# Altium schematic sheet Main.SchDoc: Плата
size 594 x 420 mm; CompanyName: ООО "ЛАССАРД"; Address1: Address1; Address2: Address2; Address3: Address3; Address4: Address4; DocumentNumber: *Э3; SheetNumber: 1; SheetTotal: 15; Title2str: управления; DocumentType: Схема электрическая принципиальная
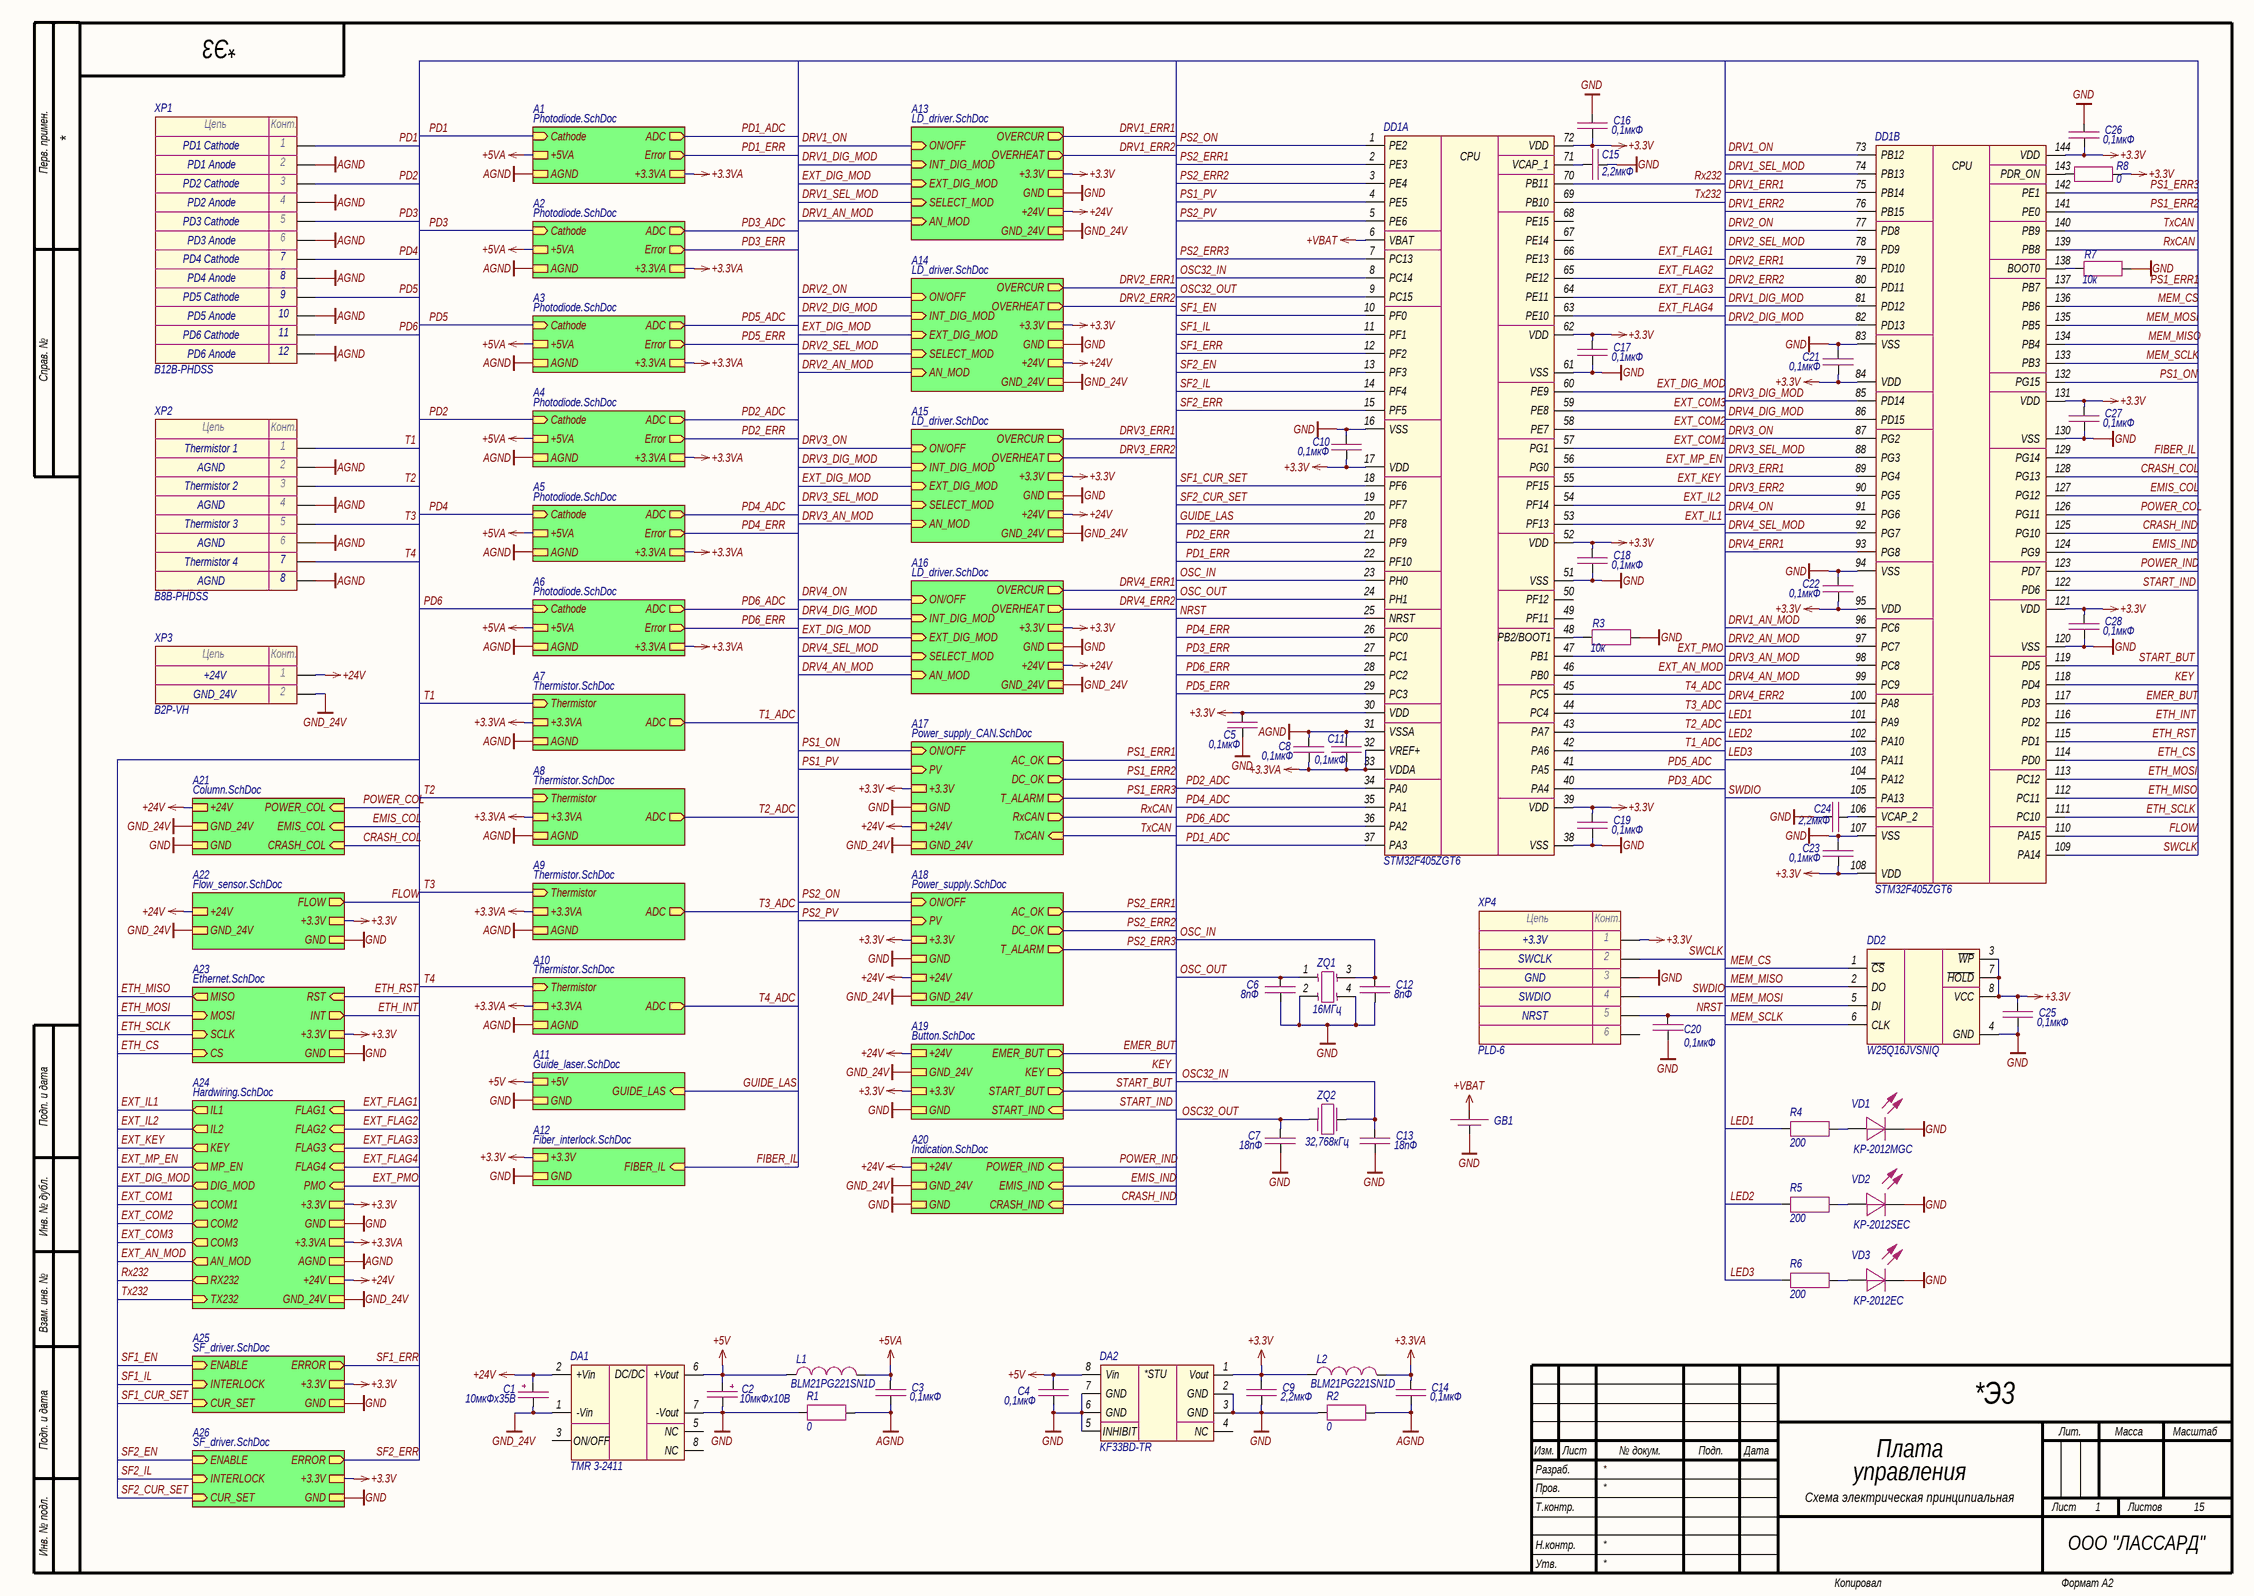
[diagram p0: Main.SchDoc]

## Parts
C1  10мкФх35B  [CAP_C]
C2  10мкФх10B  [CAP_A]
C3  0,1мкФ  [CAP_0603]
C4  0,1мкФ  [CAP_0603]
C5  0,1мкФ  [CAP_0603]
C6  8пФ  [CAP_0603]
C7  18пФ  [CAP_0603]
C8  0,1мкФ  [CAP_0603]
C9  2,2мкФ  [CAP_0603]
C10  0,1мкФ  [CAP_0603]
C11  0,1мкФ  [CAP_0603]
C12  8пФ  [CAP_0603]
C13  18пФ  [CAP_0603]
C14  0,1мкФ  [CAP_0603]
C15  2,2мкФ  [CAP_0603]
C16  0,1мкФ  [CAP_0603]
C17  0,1мкФ  [CAP_0603]
C18  0,1мкФ  [CAP_0603]
C19  0,1мкФ  [CAP_0603]
C20  0,1мкФ  [CAP_0603]
C21  0,1мкФ  [CAP_0603]
C22  0,1мкФ  [CAP_0603]
C23  0,1мкФ  [CAP_0603]
C24  2,2мкФ  [CAP_0603]
C25  0,1мкФ  [CAP_0603]
C26  0,1мкФ  [CAP_0603]
C27  0,1мкФ  [CAP_0603]
C28  0,1мкФ  [CAP_0603]
DA1  TMR 3-2411  [TMR3 (SIP-8)]
DA2  KF33BD-TR  [SOIC-8]
DD1  STM32F405ZGT6  [LQFP-144]  (parts A,B of 2)
DD2  W25Q16JVSNIQ  [SOIC-8]
GB1  DS1092-12-N8S  [DS1092-12-N8S]  (value not drawn)
L1  BLM21PG221SN1D  [IND_0805]
L2  BLM21PG221SN1D  [IND_0805]
R1  0  [RES_0805]
R2  0  [RES_0805]
R3  10к  [RES_0603]
R4  200  [RES_0603]
R5  200  [RES_0603]
R6  200  [RES_0603]
R7  10к  [RES_0603]
R8  0  [RES_0603]
VD1  KP-2012MGC  [LED_0805]
VD2  KP-2012SEC  [LED_0805]
VD3  KP-2012EC  [LED_0805]
XP1  B12B-PHDSS  [B12B-PHDSS]
XP2  B8B-PHDSS  [B8B-PHDSS]
XP3  B2P-VH  [B2P-VH]
XP4  PLD-6  [PLD-6]
ZQ1  16МГц  [NX2520SA]
ZQ2  32,768кГц  [NX3215SA]

## Sub-sheets
A1 = Photodiode.SchDoc: Cathode (in), ADC (out), Error (out), AGND, +5VA, +3.3VA
A2 = Photodiode.SchDoc: Cathode (in), ADC (out), Error (out), AGND, +5VA, +3.3VA
A3 = Photodiode.SchDoc: Cathode (in), ADC (out), Error (out), AGND, +5VA, +3.3VA
A4 = Photodiode.SchDoc: Cathode (in), ADC (out), Error (out), AGND, +5VA, +3.3VA
A5 = Photodiode.SchDoc: Cathode (in), ADC (out), Error (out), AGND, +5VA, +3.3VA
A6 = Photodiode.SchDoc: Cathode (in), ADC (out), Error (out), AGND, +5VA, +3.3VA
A7 = Thermistor.SchDoc: Thermistor (in), +3.3VA, AGND, ADC (out)
A8 = Thermistor.SchDoc: Thermistor (in), +3.3VA, AGND, ADC (out)
A9 = Thermistor.SchDoc: Thermistor (in), +3.3VA, AGND, ADC (out)
A10 = Thermistor.SchDoc: Thermistor (in), +3.3VA, AGND, ADC (out)
A11 = Guide_laser.SchDoc: GUIDE_LAS (in), +5V, GND
A12 = Fiber_interlock.SchDoc: FIBER_IL (in), +3.3V, GND
A13 = LD_driver.SchDoc: +3.3V, GND, OVERCUR (out), OVERHEAT (out), +24V, GND_24V, ON/OFF (in), INT_DIG_MOD (in), AN_MOD (in), EXT_DIG_MOD (in), SELECT_MOD (in)
A14 = LD_driver.SchDoc: +3.3V, GND, OVERCUR (out), OVERHEAT (out), +24V, GND_24V, ON/OFF (in), INT_DIG_MOD (in), AN_MOD (in), EXT_DIG_MOD (in), SELECT_MOD (in)
A15 = LD_driver.SchDoc: +3.3V, GND, OVERCUR (out), OVERHEAT (out), +24V, GND_24V, ON/OFF (in), INT_DIG_MOD (in), AN_MOD (in), EXT_DIG_MOD (in), SELECT_MOD (in)
A16 = LD_driver.SchDoc: +3.3V, GND, OVERCUR (out), OVERHEAT (out), +24V, GND_24V, ON/OFF (in), INT_DIG_MOD (in), AN_MOD (in), EXT_DIG_MOD (in), SELECT_MOD (in)
A17 = Power_supply_CAN.SchDoc: ON/OFF (in), PV (in), +3.3V, GND, +24V, GND_24V, AC_OK (out), DC_OK (out), RxCAN (out), TxCAN (in), T_ALARM (out)
A18 = Power_supply.SchDoc: ON/OFF (in), PV (in), +3.3V, GND, +24V, GND_24V, AC_OK (out), DC_OK (out), T_ALARM (out)
A19 = Button.SchDoc: EMER_BUT (out), +24V, GND_24V, +3.3V, GND, KEY (out), START_BUT (out), START_IND (in)
A20 = Indication.SchDoc: GND_24V, +24V, CRASH_IND (in), POWER_IND (in), EMIS_IND (in), GND
A21 = Column.SchDoc: GND_24V, +24V, CRASH_COL (in), POWER_COL (in), EMIS_COL (in), GND
A22 = Flow_sensor.SchDoc: FLOW (out), +24V, GND_24V, +3.3V, GND
A23 = Ethernet.SchDoc: MISO (out), RST (in), MOSI (in), INT (out), SCLK (in), CS (in), +3.3V, GND
A24 = Hardwiring.SchDoc: IL1 (out), FLAG1 (in), RX232 (out), TX232 (in), IL2 (out), KEY (out), MP_EN (out), AN_MOD (out), FLAG2 (in), FLAG3 (in), FLAG4 (in), PMO (in), +3.3VA, AGND, +3.3V, GND, GND_24V, +24V, COM1 (out), COM2 (out), COM3 (out), DIG_MOD (out)
A25 = SF_driver.SchDoc: ENABLE (in), ERROR (out), +3.3V, GND, INTERLOCK (in), CUR_SET (in)
A26 = SF_driver.SchDoc: ENABLE (in), ERROR (out), +3.3V, GND, INTERLOCK (in), CUR_SET (in)

## Nets
+3.3V: C5.1 C9.1 C10.2 C16.2 C17.1 C18.1 C19.1 C21.2 C22.2 C23.2 C25.1 C26.2 C27.1 C28.1 DA2.1(Vout) DD1.17(VDD) DD1.30(VDD) DD1.39(VDD) DD1.52(VDD) DD1.62(VDD) DD1.72(VDD) DD1.84(VDD) DD1.95(VDD) DD1.108(VDD) DD1.121(VDD) DD1.131(VDD) DD1.144(VDD) DD2.3(~{WP}) DD2.7(~{HOLD}) DD2.8(VCC) L2.1 R8.2 XP4.1 ; sheet A13/+3.3V, sheet A14/+3.3V, sheet A15/+3.3V, sheet A16/+3.3V, sheet A17/+3.3V, sheet A18/+3.3V, sheet A12/+3.3V, sheet A19/+3.3V, sheet A22/+3.3V, sheet A23/+3.3V, sheet A24/+3.3V, sheet A25/+3.3V, sheet A26/+3.3V
+3.3VA: C8.2 C11.2 C14.1 DD1.32(VREF+) DD1.33(VDDA) L2.2 ; sheet A1/+3.3VA, sheet A2/+3.3VA, sheet A3/+3.3VA, sheet A4/+3.3VA, sheet A5/+3.3VA, sheet A6/+3.3VA, sheet A7/+3.3VA, sheet A8/+3.3VA, sheet A9/+3.3VA, sheet A10/+3.3VA, sheet A24/+3.3VA
+5V: C2.1 C4.1 DA1.6(+Vout) DA2.8(Vin) L1.1 ; sheet A11/+5V
+5VA: C3.1 L1.2 ; sheet A1/+5VA, sheet A2/+5VA, sheet A3/+5VA, sheet A4/+5VA, sheet A5/+5VA, sheet A6/+5VA
+24V: C1.1 DA1.2(+Vin) XP3.1 ; sheet A13/+24V, sheet A14/+24V, sheet A15/+24V, sheet A16/+24V, sheet A17/+24V, sheet A18/+24V, sheet A19/+24V, sheet A20/+24V, sheet A21/+24V, sheet A22/+24V, sheet A24/+24V
+VBAT: DD1.6(VBAT) GB1.2
AGND: C3.2 C8.1 C11.1 C14.2 DD1.31(VSSA) R1.2 R2.2 XP1.2 XP1.4 XP1.6 XP1.8 XP1.10 XP1.12 XP2.2 XP2.4 XP2.6 XP2.8 ; sheet A1/AGND, sheet A2/AGND, sheet A3/AGND, sheet A4/AGND, sheet A5/AGND, sheet A6/AGND, sheet A7/AGND, sheet A8/AGND, sheet A9/AGND, sheet A10/AGND, sheet A24/AGND
GND: C2.2 C4.2 C5.2 C6.2 C7.2 C9.2 C10.1 C12.2 C13.2 C15.2 C16.1 C17.2 C18.2 C19.2 C20.2 C21.1 C22.1 C23.1 C24.2 C25.2 C26.1 C27.2 C28.2 DA1.7(-Vout) DA2.2(GND) DA2.3(GND) DA2.5(INHIBIT) DA2.6(GND) DA2.7(GND) DD1.16(VSS) DD1.38(VSS) DD1.51(VSS) DD1.61(VSS) DD1.83(VSS) DD1.94(VSS) DD1.107(VSS) DD1.120(VSS) DD1.130(VSS) DD2.4(GND) GB1.1 R1.1 R2.1 R3.2 R7.2 VD1.2(C) VD2.2(C) VD3.2(C) XP4.3 ZQ1.2 ZQ1.4 ; sheet A11/GND, sheet A13/GND, sheet A14/GND, sheet A15/GND, sheet A16/GND, sheet A17/GND, sheet A18/GND, sheet A12/GND, sheet A19/GND, sheet A20/GND, sheet A21/GND, sheet A22/GND, sheet A23/GND, sheet A24/GND, sheet A25/GND, sheet A26/GND
GND_24V: C1.2 DA1.1(-Vin) XP3.2 ; sheet A13/GND_24V, sheet A14/GND_24V, sheet A15/GND_24V, sheet A16/GND_24V, sheet A17/GND_24V, sheet A18/GND_24V, sheet A19/GND_24V, sheet A20/GND_24V, sheet A21/GND_24V, sheet A22/GND_24V, sheet A24/GND_24V
CRASH_COL: DD1.128(PG13) ; sheet A21/CRASH_COL
CRASH_IND: DD1.125(PG10) ; sheet A20/CRASH_IND
DRV1_AN_MOD: DD1.96(PC6) ; sheet A13/AN_MOD
DRV1_DIG_MOD: DD1.81(PD12) ; sheet A13/INT_DIG_MOD
DRV1_ERR1: DD1.75(PB14) ; sheet A13/OVERCUR
DRV1_ERR2: DD1.76(PB15) ; sheet A13/OVERHEAT
DRV1_ON: DD1.73(PB12) ; sheet A13/ON/OFF
DRV1_SEL_MOD: DD1.74(PB13) ; sheet A13/SELECT_MOD
DRV2_AN_MOD: DD1.97(PC7) ; sheet A14/AN_MOD
DRV2_DIG_MOD: DD1.82(PD13) ; sheet A14/INT_DIG_MOD
DRV2_ERR1: DD1.79(PD10) ; sheet A14/OVERCUR
DRV2_ERR2: DD1.80(PD11) ; sheet A14/OVERHEAT
DRV2_ON: DD1.77(PD8) ; sheet A14/ON/OFF
DRV2_SEL_MOD: DD1.78(PD9) ; sheet A14/SELECT_MOD
DRV3_AN_MOD: DD1.98(PC8) ; sheet A15/AN_MOD
DRV3_DIG_MOD: DD1.85(PD14) ; sheet A15/INT_DIG_MOD
DRV3_ERR1: DD1.89(PG4) ; sheet A15/OVERCUR
DRV3_ERR2: DD1.90(PG5) ; sheet A15/OVERHEAT
DRV3_ON: DD1.87(PG2) ; sheet A15/ON/OFF
DRV3_SEL_MOD: DD1.88(PG3) ; sheet A15/SELECT_MOD
DRV4_AN_MOD: DD1.99(PC9) ; sheet A16/AN_MOD
DRV4_DIG_MOD: DD1.86(PD15) ; sheet A16/INT_DIG_MOD
DRV4_ERR1: DD1.93(PG8) ; sheet A16/OVERCUR
DRV4_ERR2: DD1.100(PA8) ; sheet A16/OVERHEAT
DRV4_ON: DD1.91(PG6) ; sheet A16/ON/OFF
DRV4_SEL_MOD: DD1.92(PG7) ; sheet A16/SELECT_MOD
EMER_BUT: DD1.117(PD3) ; sheet A19/EMER_BUT
EMIS_COL: DD1.127(PG12) ; sheet A21/EMIS_COL
EMIS_IND: DD1.124(PG9) ; sheet A20/EMIS_IND
ETH_CS: DD1.114(PD0) ; sheet A23/CS
ETH_INT: DD1.116(PD2) ; sheet A23/INT
ETH_MISO: DD1.112(PC11) ; sheet A23/MISO
ETH_MOSI: DD1.113(PC12) ; sheet A23/MOSI
ETH_RST: DD1.115(PD1) ; sheet A23/RST
ETH_SCLK: DD1.111(PC10) ; sheet A23/SCLK
EXT_AN_MOD: DD1.46(PB0) ; sheet A24/AN_MOD
EXT_COM1: DD1.57(PG1) ; sheet A24/COM1
EXT_COM2: DD1.58(PE7) ; sheet A24/COM2
EXT_COM3: DD1.59(PE8) ; sheet A24/COM3
EXT_DIG_MOD: DD1.60(PE9) ; sheet A13/EXT_DIG_MOD, sheet A14/EXT_DIG_MOD, sheet A15/EXT_DIG_MOD, sheet A16/EXT_DIG_MOD, sheet A24/DIG_MOD
EXT_FLAG1: DD1.66(PE13) ; sheet A24/FLAG1
EXT_FLAG2: DD1.65(PE12) ; sheet A24/FLAG2
EXT_FLAG3: DD1.64(PE11) ; sheet A24/FLAG3
EXT_FLAG4: DD1.63(PE10) ; sheet A24/FLAG4
EXT_IL1: DD1.53(PF13) ; sheet A24/IL1
EXT_IL2: DD1.54(PF14) ; sheet A24/IL2
EXT_KEY: DD1.55(PF15) ; sheet A24/KEY
EXT_MP_EN: DD1.56(PG0) ; sheet A24/MP_EN
EXT_PMO: DD1.47(PB1) ; sheet A24/PMO
FIBER_IL: DD1.129(PG14) ; sheet A12/FIBER_IL
FLOW: DD1.110(PA15) ; sheet A22/FLOW
GUIDE_LAS: DD1.20(PF8) ; sheet A11/GUIDE_LAS
KEY: DD1.118(PD4) ; sheet A19/KEY
LED1: DD1.101(PA9) R4.1
LED2: DD1.102(PA10) R5.1
LED3: DD1.103(PA11) R6.1
MEM_CS: DD1.136(PB6) DD2.1(~{CS})
MEM_MISO: DD1.134(PB4) DD2.2(DO)
MEM_MOSI: DD1.135(PB5) DD2.5(DI)
MEM_SCLK: DD1.133(PB3) DD2.6(CLK)
NRST: C20.1 DD1.25(NRST) XP4.5
OSC32_IN: C13.1 DD1.8(PC14) ZQ2.2
OSC32_OUT: C7.1 DD1.9(PC15) ZQ2.1
OSC_IN: C12.1 DD1.23(PH0) ZQ1.3
OSC_OUT: C6.1 DD1.24(PH1) ZQ1.1
PD1: XP1.1 ; sheet A1/Cathode
PD1_ADC: DD1.37(PA3) ; sheet A1/ADC
PD1_ERR: DD1.22(PF10) ; sheet A1/Error
PD2: XP1.3 ; sheet A4/Cathode
PD2_ADC: DD1.34(PA0) ; sheet A4/ADC
PD2_ERR: DD1.21(PF9) ; sheet A4/Error
PD3: XP1.5 ; sheet A2/Cathode
PD3_ADC: DD1.40(PA4) ; sheet A2/ADC
PD3_ERR: DD1.27(PC1) ; sheet A2/Error
PD4: XP1.7 ; sheet A5/Cathode
PD4_ADC: DD1.35(PA1) ; sheet A5/ADC
PD4_ERR: DD1.26(PC0) ; sheet A5/Error
PD5: XP1.9 ; sheet A3/Cathode
PD5_ADC: DD1.41(PA5) ; sheet A3/ADC
PD5_ERR: DD1.29(PC3) ; sheet A3/Error
PD6: XP1.11 ; sheet A6/Cathode
PD6_ADC: DD1.36(PA2) ; sheet A6/ADC
PD6_ERR: DD1.28(PC2) ; sheet A6/Error
POWER_COL: DD1.126(PG11) ; sheet A21/POWER_COL
POWER_IND: DD1.123(PD7) ; sheet A20/POWER_IND
PS1_ERR1: DD1.137(PB7) ; sheet A17/AC_OK
PS1_ERR2: DD1.141(PE0) ; sheet A17/DC_OK
PS1_ERR3: DD1.142(PE1) ; sheet A17/T_ALARM
PS1_ON: DD1.132(PG15) ; sheet A17/ON/OFF
PS1_PV: DD1.4(PE5) ; sheet A17/PV
PS2_ERR1: DD1.2(PE3) ; sheet A18/AC_OK
PS2_ERR2: DD1.3(PE4) ; sheet A18/DC_OK
PS2_ERR3: DD1.7(PC13) ; sheet A18/T_ALARM
PS2_ON: DD1.1(PE2) ; sheet A18/ON/OFF
PS2_PV: DD1.5(PE6) ; sheet A18/PV
Rx232: DD1.70(PB11) ; sheet A24/RX232
RxCAN: DD1.139(PB8) ; sheet A17/RxCAN
SF1_CUR_SET: DD1.18(PF6) ; sheet A25/CUR_SET
SF1_EN: DD1.10(PF0) ; sheet A25/ENABLE
SF1_ERR: DD1.12(PF2) ; sheet A25/ERROR
SF1_IL: DD1.11(PF1) ; sheet A25/INTERLOCK
SF2_CUR_SET: DD1.19(PF7) ; sheet A26/CUR_SET
SF2_EN: DD1.13(PF3) ; sheet A26/ENABLE
SF2_ERR: DD1.15(PF5) ; sheet A26/ERROR
SF2_IL: DD1.14(PF4) ; sheet A26/INTERLOCK
START_BUT: DD1.119(PD5) ; sheet A19/START_BUT
START_IND: DD1.122(PD6) ; sheet A19/START_IND
SWCLK: DD1.109(PA14) XP4.2
SWDIO: DD1.105(PA13) XP4.4
T1: XP2.1 ; sheet A7/Thermistor
T1_ADC: DD1.42(PA6) ; sheet A7/ADC
T2: XP2.3 ; sheet A8/Thermistor
T2_ADC: DD1.43(PA7) ; sheet A8/ADC
T3: XP2.5 ; sheet A9/Thermistor
T3_ADC: DD1.44(PC4) ; sheet A9/ADC
T4: XP2.7 ; sheet A10/Thermistor
T4_ADC: DD1.45(PC5) ; sheet A10/ADC
Tx232: DD1.69(PB10) ; sheet A24/TX232
TxCAN: DD1.140(PB9) ; sheet A17/TxCAN
NetC15_1: C15.1 DD1.71(VCAP_1)
NetC24_1: C24.1 DD1.106(VCAP_2)
NetDD1_48: DD1.48(PB2/BOOT1) R3.1
NetDD1_138: DD1.138(BOOT0) R7.1
NetDD1_143: DD1.143(PDR_ON) R8.1
NetR4_2: R4.2 VD1.1(A)
NetR5_2: R5.2 VD2.1(A)
NetR6_2: R6.2 VD3.1(A)

Not connected (* = marked no-connect by the designer): DA1 3(ON/OFF) 5(NC) 8(NC); DA2 4(NC); DD1 49(PF11) 50(PF12) 67(PE14) 68(PE15) 104(PA12); XP4 6

## Notes on the sheet
- PD1 Cathode
- PD1 Anode
- PD2 Cathode
- PD2 Anode
- PD3 Cathode
- PD3 Anode
- PD4 Cathode
- PD4 Anode
- PD5 Cathode
- PD5 Anode
- PD6 Cathode
- PD6 Anode
- Thermistor 1
- AGND
- Thermistor 2
- Thermistor 3
- Thermistor 4
- +24V
- GND_24V
- +3.3V
- GND
- SWCLK
- SWDIO
- NRST
- Перв. примен.
- Справ. №
- Подп. и дата
- Инв. № дубл.
- Взам. инв. №
- Разраб.
- Изм.
- Лист
- № докум.
- Подп.
- Дата
- Лит.
- Масса
- Масштаб
- Пров.
- Т.контр.
- Листов
- Инв. № подл.
- Утв.
- Н.контр.
- Копировал
- Формат А2
- (in symbol Connector-2) Цепь; Конт.
- (in symbol Connector-6) Цепь; Конт.
- (in symbol Connector-8) Цепь; Конт.
- (in symbol Connector-12) Цепь; Конт.
- (in symbol KFXXBD-TR) *STU
- (in symbol STM32F405ZG, part A) CPU
- (in symbol STM32F405ZG, part B) CPU
- (in symbol TMR3) DC/DC

## Library data of the parts
C1 = Capacitor_Polar: Model: TECAP, 10 мкФ, 35 В, тип C, 10%; Value: 10мкФх35B; Document: *; Manufacturer: *
C2 = Capacitor_Polar: Model: TECAP, 10 мкФ, 10 В, тип A, 10%; Value: 10мкФх10B; Document: *; Manufacturer: *
C3-C5 C8 C10 C11 C14 C16-C23 C25-C28 = Capacitor: Manufacturer: Murata; Model: GRM188R71H104KA93D; Value: 0,1мкФ; Document: *
C6 C12 = Capacitor: Manufacturer: Yageo; Model: CC0603CRNPO9BN8R0; Value: 8пФ; Document: *
C7 C13 = Capacitor: Manufacturer: Murata; Model: GRM1885C1H180FA01D; Value: 18пФ; Document: *
C9 C15 C24 = Capacitor: Manufacturer: Murata; Model: GRM188R61H225KE11D; Value: 2,2мкФ; Document: *
DA1 = TMR3: Manufacturer: Traco Power; Model: TMR 3-2411; Document: *
DA2 = KFXXBD-TR: Manufacturer: STMicroelectronics; Model: KF33BD-TR; Document: *
DD1 = STM32F405ZG: Manufacturer: STMicroelectronics; Model: STM32F405ZGT6; Document: *
DD2 = W25Q: Manufacturer: Winbond; Model: W25Q16JVSNIQ; Document: *
GB1 = Accumulator: Manufacturer: Connfly; Model: DS1092-12-N8S; Document: *
L1 L2 = Inductor: Manufacturer: Murata; Value: *; Model: BLM21PG221SN1D; Document: *
R1 R2 = Resistor: Manufacturer: Yageo; Model: RC0805FR-070RL; Value: 0; Document: *
R3 R7 = Resistor: Manufacturer: Yageo; Model: RC0603FR-0710KL; Value: 10к; Document: *
R4-R6 = Resistor: Manufacturer: Yageo; Model: RC0603FR-07200RL; Value: 200; Document: *
R8 = Resistor: Manufacturer: Yageo; Model: RC0603JR-070RL; Value: 0; Document: *
VD1-VD3 = LED: Manufacturer: Kingbright; Document: *
  VD1: Model: KP-2012MGC
  VD2: Model: KP-2012SEC
  VD3: Model: KP-2012EC
XP1 = Connector-12: Manufacturer: JST; Model: B12B-PHDSS; Document: *
XP2 = Connector-8: Manufacturer: JST; Model: B8B-PHDSS; Document: *
XP3 = Connector-2: Manufacturer: JST; Model: B2P-VH; Document: *
XP4 = Connector-6: Manufacturer: Connfly; Model: PLD-6; Document: *
ZQ1 = Quartz_Resonator_4-pin: Manufacturer: NDK; Model: NX2520SA-16MHZ-STD-CSW-5; Value: 16МГц; Document: *
ZQ2 = Quartz_Resonator: Manufacturer: NDK; Model: NX3215SA- 32.768K-STD-MUA-8; Value: 32,768кГц; Document: *